# EAGLE design Supply-01 (EAGLE 6.2)
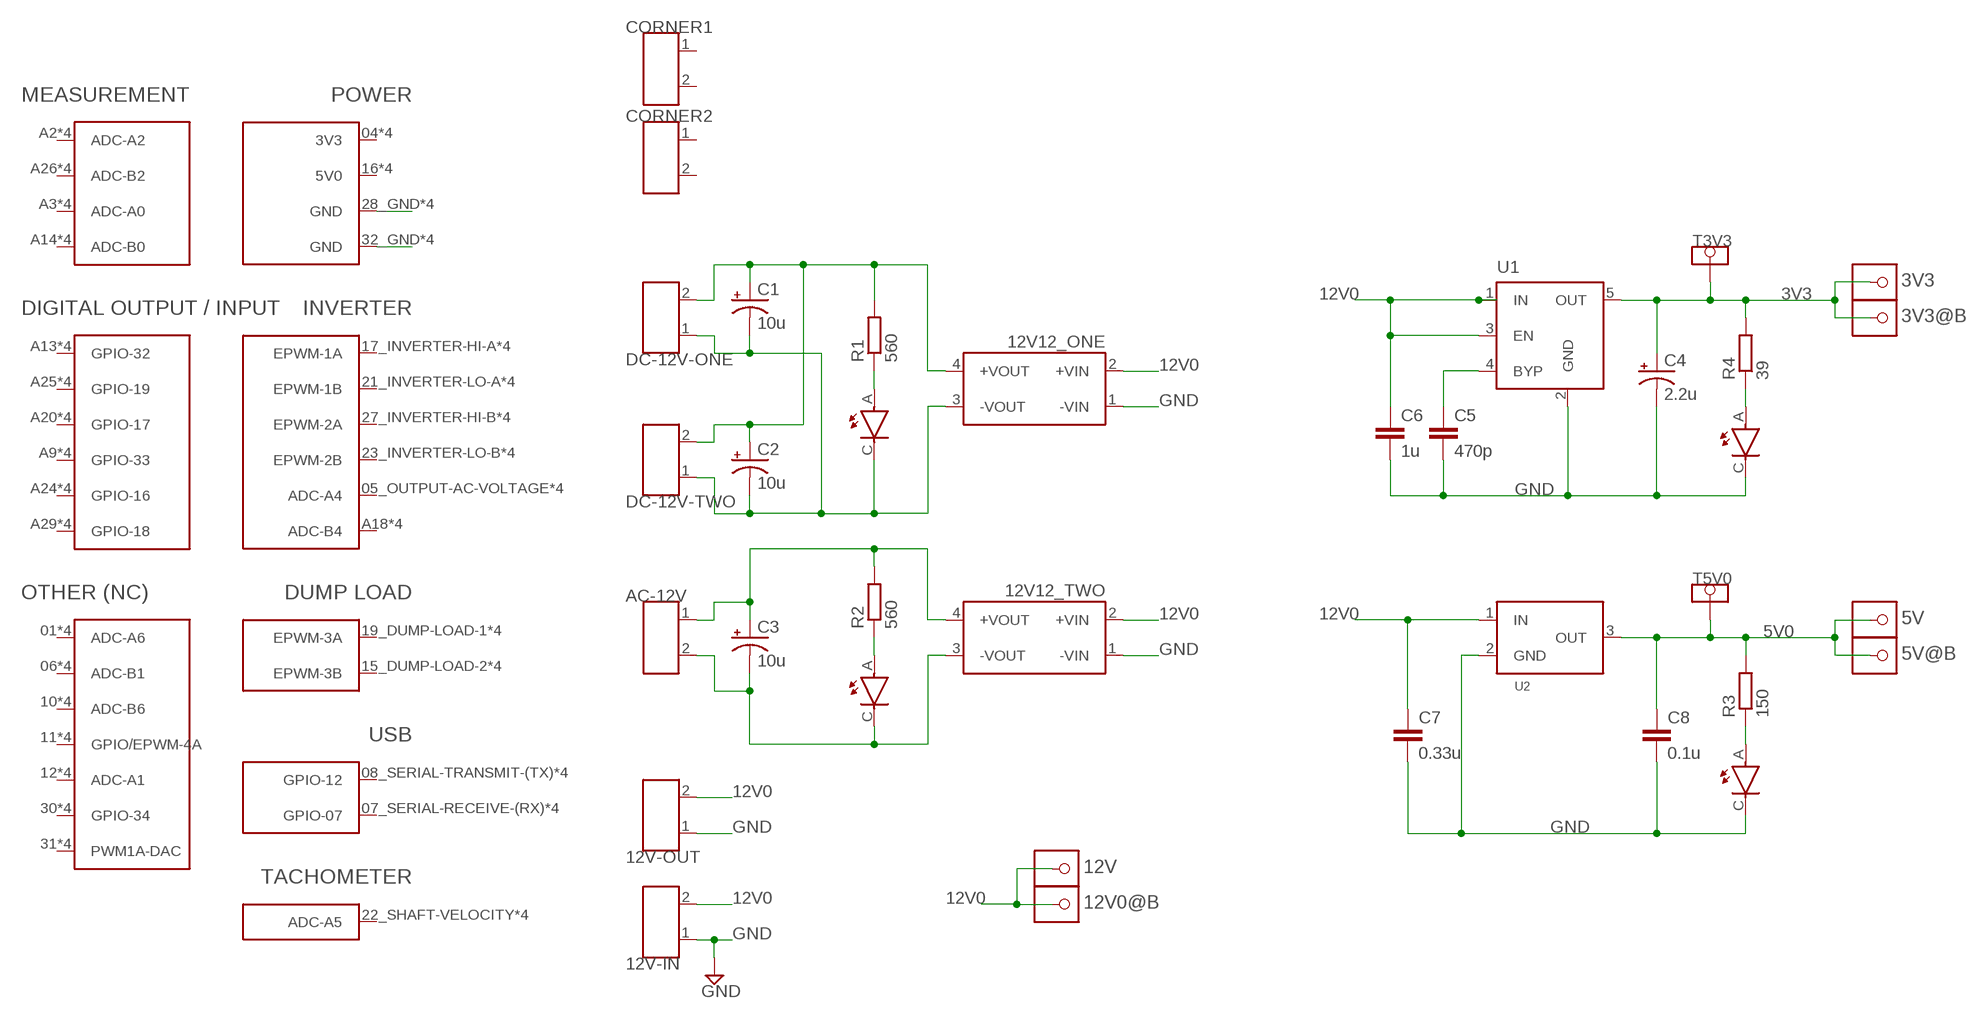
[diagram p0: schematic, sheet 1]

## Parts
3V3  1X1STACK  [1X1STACK]
3V3@B  1X1STACK  [1X1STACK]
5V  1X1STACK  [1X1STACK]
5V@B  1X1STACK  [1X1STACK]
12V  1X1STACK  [1X1STACK]
12V0@B  1X1STACK  [1X1STACK]
12V12_ONE  12V12_ISO_REG  [SIL_REG]
12V12_TWO  12V12_ISO_REG  [SIL_REG]
12V-IN  1X2_7,5_TB  [1X2_7,5_TB]
12V-OUT  1X2_7,5_TB  [1X2_7,5_TB]
AC-12V  1X2_7,5_TB  [1X2_7,5_TB]
C1  10u  CPOL-4MM  [CPOL-4.0MM]
C2  10u  CPOL-4MM  [CPOL-4.0MM]
C3  10u  CPOL-4MM  [CPOL-4.0MM]
C4  2.2u  CPOL-4MM  [CPOL-4.0MM]
C5  470p  C-EUC0805  [C0805]
C6  1u  C-EUC0805  [C0805]
C7  0.33u  C-EUC0805  [C0805]
C8  0.1u  C-EUC0805  [C0805]
CORNER1  1X2_7,5_TB  [1X2_7,5_TB]
CORNER2  1X2_7,5_TB  [1X2_7,5_TB]
DC-12V-ONE  1X2_7,5_TB  [1X2_7,5_TB]
DC-12V-TWO  1X2_7,5_TB  [1X2_7,5_TB]
H1  CONTROLLER_STACK  [CONTROLLER_STACK]
LED1  PLCC2  [PLCC2]
LED2  PLCC2  [PLCC2]
LED3  PLCC2  [PLCC2]
LED4  PLCC2  [PLCC2]
R1  560  R-EU_R0805  [R0805]
R2  560  R-EU_R0805  [R0805]
R3  150  R-EU_R0805  [R0805]
R4  39  R-EU_R0805  [R0805]
T3V3  TESTPAD  [TESTPAD]
T5V0  TESTPAD  [TESTPAD]
U1  MIC5219XX  [SOT23-5]
U2  10V5V-REG-H  [TO-220H]

## Nets
3V3: 3V3.P$2 3V3.P$5 3V3.P$58 3V3.P$65 3V3.PAD 3V3@B.P$2 3V3@B.P$5 3V3@B.P$58 3V3@B.P$65 3V3@B.PAD C4.+ R4.2 T3V3.TP U1.5(OUT)
5V0 [Power]: 5V.P$2 5V.P$5 5V.P$58 5V.P$65 5V.PAD 5V@B.P$2 5V@B.P$5 5V@B.P$58 5V@B.P$65 5V@B.PAD C8.1 R3.2 T5V0.TP U2.3(OUT)
12V0 [Power]: 12V0@B.P$2 12V0@B.P$5 12V0@B.P$58 12V0@B.P$65 12V0@B.PAD 12V12_ONE.2(+VIN) 12V12_TWO.2(+VIN) 12V-IN.2 12V-OUT.2 12V.P$2 12V.P$5 12V.P$58 12V.P$65 12V.PAD C6.1 C7.1 U1.1(IN) U1.3(EN) U2.1(IN)
GND [Power]: 12V12_ONE.1(-VIN) 12V12_TWO.1(-VIN) 12V-IN.1 12V-OUT.1 C4.- C5.2 C6.2 C7.2 C8.2 H1.28_GND(GND) H1.32_GND(GND) H1.A28(GND) H1.A32(GND) H1.B28(GND) H1.B32(GND) H1.C28(GND) H1.C32(GND) LED3.C LED4.C U1.2(GND) U2.2(GND)
N$1 [Power]: 12V12_ONE.4(+VOUT) C1.+ C2.+ DC-12V-ONE.2 DC-12V-TWO.2 R1.2
N$2 [Power]: 12V12_ONE.3(-VOUT) C1.- C2.- DC-12V-ONE.1 DC-12V-TWO.1 LED1.C
N$3: LED1.A R1.1
N$4: LED3.A R3.1
N$6 [Power]: 12V12_TWO.3(-VOUT) AC-12V.2 C3.- LED2.C
N$7: C5.1 U1.4(BYP)
N$8: LED2.A R2.1
N$10 [Power]: 12V12_TWO.4(+VOUT) AC-12V.1 C3.+ R2.2
N$12: LED4.A R4.1
Unconnected: CORNER1.1 CORNER1.2 CORNER2.1 CORNER2.2 H1.01(ADC-A6) H1.04(3V3) H1.05_OUTPUT-AC-VOLTAGE(ADC-A4) H1.06(ADC-B1) H1.07_SERIAL-RECEIVE-(RX)(GPIO-07) H1.08_SERIAL-TRANSMIT-(TX)(GPIO-12) H1.10(ADC-B6) H1.11(GPIO/EPWM-4A) H1.12(ADC-A1) H1.15_DUMP-LOAD-2(EPWM-3B) H1.16(5V0) H1.17_INVERTER-HI-A(EPWM-1A) H1.19_DUMP-LOAD-1(EPWM-3A) H1.21_INVERTER-LO-A(EPWM-1B) H1.22_SHAFT-VELOCITY(ADC-A5) H1.23_INVERTER-LO-B(EPWM-2B) H1.27_INVERTER-HI-B(EPWM-2A) H1.30(GPIO-34) H1.31(PWM1A-DAC) H1.A1(ADC-A6) H1.A2(ADC-A2) H1.A3(ADC-A0) H1.A4(3V3) H1.A5(ADC-A4) H1.A6(ADC-B1) H1.A7(GPIO-07) H1.A8(GPIO-12) H1.A9(GPIO-33) H1.A10(ADC-B6) H1.A11(GPIO/EPWM-4A) H1.A12(ADC-A1) H1.A13(GPIO-32) H1.A14(ADC-B0) H1.A15(EPWM-3B) H1.A16(5V0) H1.A17(EPWM-1A) H1.A18(ADC-B4) H1.A19(EPWM-3A) H1.A20(GPIO-17) H1.A21(EPWM-1B) H1.A22(ADC-A5) H1.A23(EPWM-2B) H1.A24(GPIO-16) H1.A25(GPIO-19) H1.A26(ADC-B2) H1.A27(EPWM-2A) H1.A29(GPIO-18) H1.A30(GPIO-34) H1.A31(PWM1A-DAC) H1.AC-INPUT-CURRENT_14(ADC-B0) H1.AC-OUTPUT-CURRENT_18(ADC-B4) H1.B1(ADC-A6) H1.B2(ADC-A2) H1.B3(ADC-A0) H1.B4(3V3) H1.B5(ADC-A4) H1.B6(ADC-B1) H1.B7(GPIO-07) H1.B8(GPIO-12) H1.B9(GPIO-33) H1.B10(ADC-B6) H1.B11(GPIO/EPWM-4A) H1.B12(ADC-A1) H1.B13(GPIO-32) H1.B14(ADC-B0) H1.B15(EPWM-3B) H1.B16(5V0) H1.B17(EPWM-1A) H1.B18(ADC-B4) H1.B19(EPWM-3A) H1.B20(GPIO-17) H1.B21(EPWM-1B) H1.B22(ADC-A5) H1.B23(EPWM-2B) H1.B24(GPIO-16) H1.B25(GPIO-19) H1.B26(ADC-B2) H1.B27(EPWM-2A) H1.B29(GPIO-18) H1.B30(GPIO-34) H1.B31(PWM1A-DAC) H1.C1(ADC-A6) H1.C2(ADC-A2) H1.C3(ADC-A0) H1.C4(3V3) H1.C5(ADC-A4) H1.C6(ADC-B1) H1.C7(GPIO-07) H1.C8(GPIO-12) H1.C9(GPIO-33) H1.C10(ADC-B6) H1.C11(GPIO/EPWM-4A) H1.C12(ADC-A1) H1.C13(GPIO-32) H1.C14(ADC-B0) H1.C15(EPWM-3B) H1.C16(5V0) H1.C17(EPWM-1A) H1.C18(ADC-B4) H1.C19(EPWM-3A) H1.C20(GPIO-17) H1.C21(EPWM-1B) H1.C22(ADC-A5) H1.C23(EPWM-2B) H1.C24(GPIO-16) H1.C25(GPIO-19) H1.C26(ADC-B2) H1.C27(EPWM-2A) H1.C29(GPIO-18) H1.C30(GPIO-34) H1.C31(PWM1A-DAC) H1.CLOCK-OUT-1_13(GPIO-32) H1.CLOCK-OUT-2_25(GPIO-19) H1.CLOCK_09(GPIO-33) H1.DATA-IN_24(GPIO-16) H1.DATA-OUT_20(GPIO-17) H1.DC-BRIDGE-CURRENT_02(ADC-A2) H1.DC-BRIDGE-VOLTAGE_26(ADC-B2) H1.INPUT-AC-VOLTAGE_03(ADC-A0) H1.LOAD_29(GPIO-18)

## Library data of the parts
3V3 3V3@B 5V 5V@B 12V 12V0@B = headers v6-2:1X1STACK
12V12_ONE 12V12_TWO = PCB_ControlStack:12V12_ISO_REG: Isolated Voltage regulator
12V-IN 12V-OUT AC-12V CORNER1 CORNER2 DC-12V-ONE DC-12V-TWO = headers v6-2:1X2_7,5_TB: Straight terminal block 7.5mm pitch
C1-C4 = PCB_ControlStack:CPOL-4MM
C5-C8 = rcl:C-EU: CAPACITOR, European symbol
H1 = PCB_ControlStack:CONTROLLER_STACK
LED1-LED4 = PCB_ControlStack:PLCC2
R1-R4 = rcl:R-EU_: RESISTOR, European symbol
T3V3 T5V0 = PCB_ControlStack:TESTPAD
U1 = v-reg-micrel:MIC5219XX: VOLTAGE REGULATOR; OC_FARNELL: unknown; OC_NEWARK: unknown
U2 = PCB_ControlStack:10V5V-REG-H

## Net classes
0 Signal: width 0.15 mm, drill 0.5 mm, clearance 0.6 mm
1 Power: width 1.42 mm, drill 0.8 mm, clearance 0.65 mm

## Board
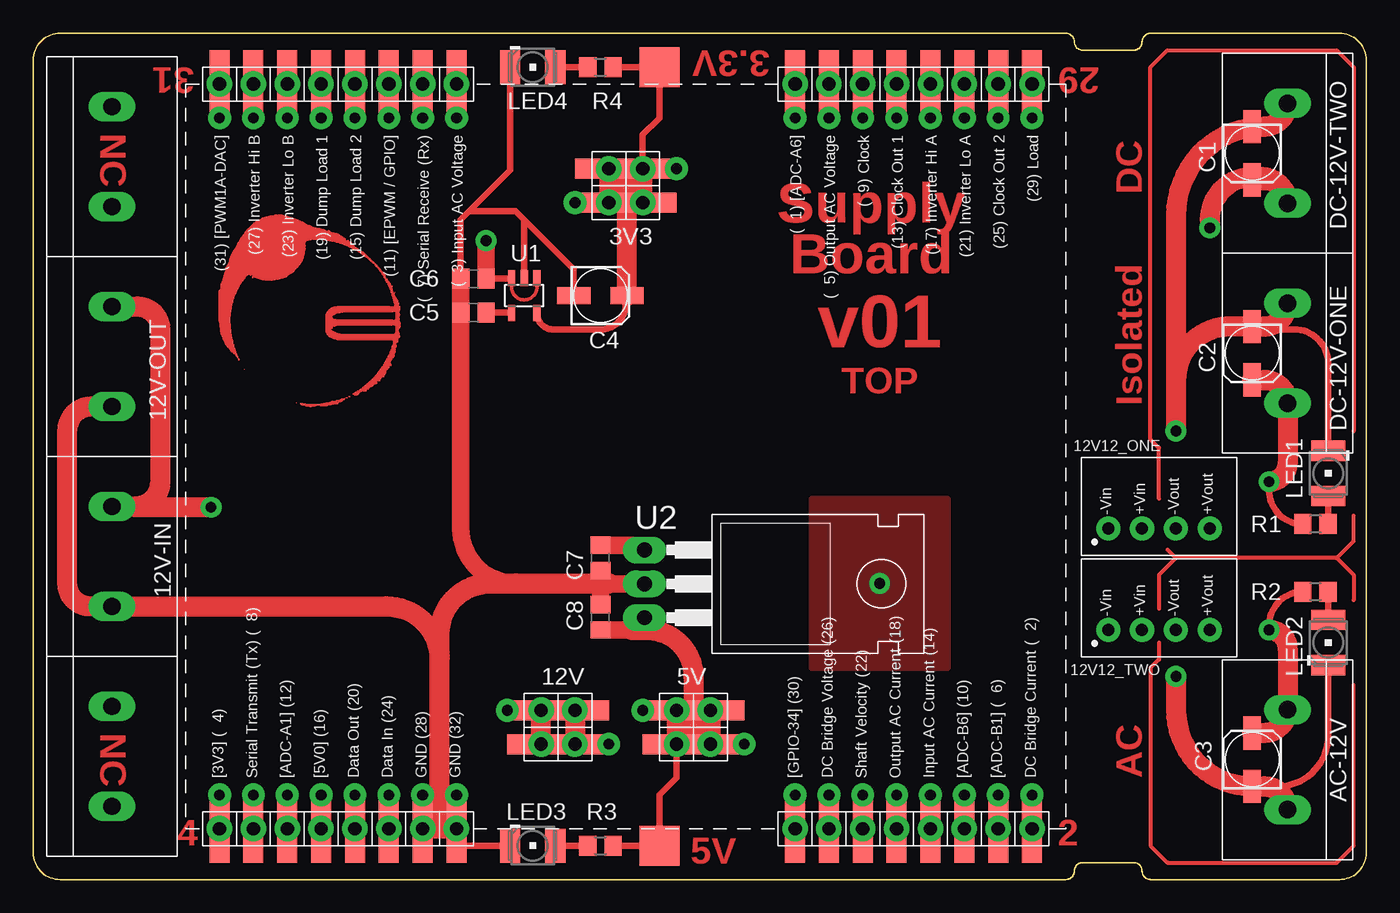
[diagram p1: board, top side]
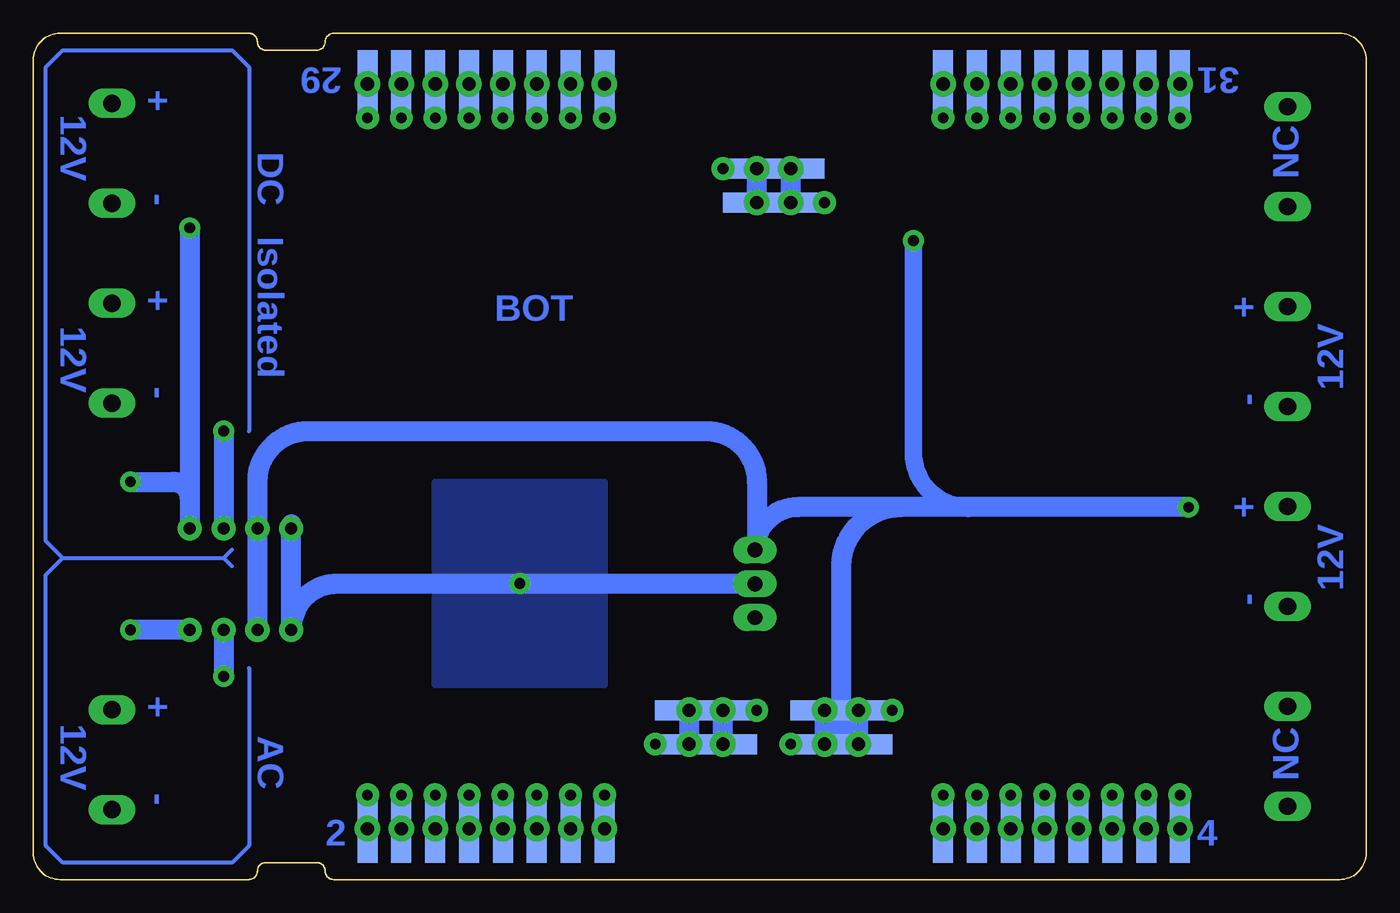
[diagram p2: board, bottom side, seen from below]

Size 100 x 63.5 mm. Coordinates in mm from the lower left corner, seen from the top.
Outline: 2,0 77.47,0 arc90 78.11,0.64 arc-90 78.74,1.27 82.55,1.27 arc-90 83.19,0.64 arc90 83.82,0 85.09,0 98,0 arc90 100,2 100,61.5 arc90 98,63.5 83.82,63.5 arc90 83.19,62.87 arc-90 82.55,62.23 78.74,62.23 arc-90 78.11,62.87 arc90 77.47,63.5 2,63.5 arc90 0,61.5 0,2 arc90 2,0
Copper layers (1*16): Top 0.035mm / dielectric 1.5mm / Bottom 0.035mm
Design rules: minimum track width 12mil, minimum drill 0.7mm, track to track 25mil, track to pad 20mil, pad to pad 15mil, via to via 20mil, smd to smd 0mil, copper to edge 40mil, drill to drill 10mil, minimum pad ring 18mil, minimum via ring 15mil, stop-mask expansion 0mil, vias tented up to drill 0mil, thermal gap 15mil
tRestrict: 8 lines
bRestrict: 8 lines

### Footprints (pad centres in the part's own frame; a part is rotated, then mirrored left to right if it is on the bottom)
1X1STACK = drill 1: P$2 -1.27,0; PAD 1.27,0 | drill 0.8: P$5 3.81,0 | smd 7.62 x 1.5 bottom: P$58 0,0 | smd 7.62 x 1.5: P$65 0,0
SIL_REG = drill 0.9 pad 1.422: 1 0,3.81; 2 0,1.27; 3 0,-1.27; 4 0,-3.81
1X2_7,5_TB = drill 1.3 long: 1 0,3.75; 2 0,-3.75
CPOL-4.0MM = smd 2.5 x 1.3: + 2,0; - -2,0
C0805 = smd 1.3 x 1.5: 1 -0.95,0; 2 0.95,0
CONTROLLER_STACK = drill 1: 01 -27.94,12.7; 04 27.94,-30.48; 05_OUTPUT-AC-VOLTAGE -27.94,15.24; 06 27.94,27.94; 07_SERIAL-RECEIVE-(RX) -27.94,-15.24; 08_SERIAL-TRANSMIT-(TX) 27.94,-27.94; 10 27.94,25.4; 11 -27.94,-17.78; 12 27.94,-25.4; 15_DUMP-LOAD-2 -27.94,-20.32; 16 27.94,-22.86; 17_INVERTER-HI-A -27.94,22.86; 19_DUMP-LOAD-1 -27.94,-22.86; 21_INVERTER-LO-A -27.94,25.4; 22_SHAFT-VELOCITY 27.94,17.78; 23_INVERTER-LO-B -27.94,-25.4; 27_INVERTER-HI-B -27.94,-27.94; 28_GND 27.94,-15.24; 30 27.94,12.7; 31 -27.94,-30.48; 32_GND 27.94,-12.7; AC-INPUT-CURRENT_14 27.94,22.86; AC-OUTPUT-CURRENT_18 27.94,20.32; CLOCK-OUT-1_13 -27.94,20.32; CLOCK-OUT-2_25 -27.94,27.94; CLOCK_09 -27.94,17.78; DATA-IN_24 27.94,-17.78; DATA-OUT_20 27.94,-20.32; DC-BRIDGE-CURRENT_02 27.94,30.48; DC-BRIDGE-VOLTAGE_26 27.94,15.24; INPUT-AC-VOLTAGE_03 -27.94,-12.7; LOAD_29 -27.94,30.48 | smd 5.08 x 1.5: A1 -27.94,12.7; A2 27.94,30.48; A3 -27.94,-12.7; A4 27.94,-30.48; A5 -27.94,15.24; A6 27.94,27.94; A7 -27.94,-15.24; A8 27.94,-27.94; A9 -27.94,17.78; A10 27.94,25.4; A11 -27.94,-17.78; A12 27.94,-25.4; A13 -27.94,20.32; A14 27.94,22.86; A15 -27.94,-20.32; A16 27.94,-22.86; A17 -27.94,22.86; A18 27.94,20.32; A19 -27.94,-22.86; A20 27.94,-20.32; A21 -27.94,25.4; A22 27.94,17.78; A23 -27.94,-25.4; A24 27.94,-17.78; A25 -27.94,27.94; A26 27.94,15.24; A27 -27.94,-27.94; A28 27.94,-15.24; A29 -27.94,30.48; A30 27.94,12.7; A31 -27.94,-30.48; A32 27.94,-12.7 | smd 5.08 x 1.5 bottom: B1 -27.94,12.7; B2 27.94,30.48; B3 -27.94,-12.7; B4 27.94,-30.48; B5 -27.94,15.24; B6 27.94,27.94; B7 -27.94,-15.24; B8 27.94,-27.94; B9 -27.94,17.78; B10 27.94,25.4; B11 -27.94,-17.78; B12 27.94,-25.4; B13 -27.94,20.32; B14 27.94,22.86; B15 -27.94,-20.32; B16 27.94,-22.86; B17 -27.94,22.86; B18 27.94,20.32; B19 -27.94,-22.86; B20 27.94,-20.32; B21 -27.94,25.4; B22 27.94,17.78; B23 -27.94,-25.4; B24 27.94,-17.78; B25 -27.94,27.94; B26 27.94,15.24; B27 -27.94,-27.94; B28 27.94,-15.24; B29 -27.94,30.48; B30 27.94,12.7; B31 -27.94,-30.48; B32 27.94,-12.7 | drill 0.8: C1 -25.4,12.7; C2 25.4,30.48; C3 -25.4,-12.7; C4 25.4,-30.48; C5 -25.4,15.24; C6 25.4,27.94; C7 -25.4,-15.24; C8 25.4,-27.94; C9 -25.4,17.78; C10 25.4,25.4; C11 -25.4,-17.78; C12 25.4,-25.4; C13 -25.4,20.32; C14 25.4,22.86; C15 -25.4,-20.32; C16 25.4,-22.86; C17 -25.4,22.86; C18 25.4,20.32; C19 -25.4,-22.86; C20 25.4,-20.32; C21 -25.4,25.4; C22 25.4,17.78; C23 -25.4,-25.4; C24 25.4,-17.78; C25 -25.4,27.94; C26 25.4,15.24; C27 -25.4,-27.94; C28 25.4,-15.24; C29 -25.4,30.48; C30 25.4,12.7; C31 -25.4,-30.48; C32 25.4,-12.7
PLCC2 = smd 2.54 x 1.524: A 0,1.702; C 0,-1.702
R0805 = smd 1.3 x 1.5: 1 -0.95,0; 2 0.95,0
TESTPAD = smd 3 x 3: TP 0,0
SOT23-5 = smd 0.55 x 1.2: 1 -0.95,-1.3; 2 0,-1.3; 3 0.95,-1.3; 4 0.95,1.3; 5 -0.95,1.3
TO-220H = drill 1.118 long: 1 -2.54,-7.62; 2 0,-7.62; 3 2.54,-7.62

### Placement (x,y rotation side)
3V3  44.45,53.34 0 top
3V3@B  44.45,50.8 180 top
5V  49.53,12.7 180 top
5V@B  49.53,10.16 0 top
12V  39.37,12.7 180 top
12V0@B  39.37,10.16 0 top
12V12_ONE  84.45,26.35 90 top
12V12_TWO  84.45,18.73 90 top
12V-IN  5.9,24.25 180 top
12V-OUT  5.9,39.25 180 top
AC-12V  94.1,9 0 top
C1  91.44,54.5 270 top
C2  91.44,39.5 270 top
C3  91.44,9 90 top
C4  42.55,43.81 0 top
C5  33.02,42.55 180 top
C6  33.02,45.09 180 top
C7  42.55,24.13 270 top
C8  42.55,19.68 90 top
CORNER1  5.9,54.25 180 top
CORNER2  5.9,9.25 180 top
DC-12V-ONE  94.1,39.5 0 top
DC-12V-TWO  94.1,54.5 0 top
H1  44.45,31.75 270 top
LED1  97.16,30.48 180 top
LED2  97.16,17.78 0 top
LED3  37.47,2.54 270 top
LED4  37.47,60.96 270 top
R1  96.19,26.67 180 top
R2  96.19,21.59 180 top
R3  42.55,2.54 0 top
R4  42.55,60.96 0 top
T3V3  46.99,60.96 0 top
T5V0  46.99,2.54 0 top
U1  36.83,43.81 180 top
U2  53.47,22.19 270 top

### Tracks (layer width: path | path; a pad name or v marks a point on that pad's centre or on a via)
3V3
  Top 0.5: R4.2 T3V3.TP 46.99,57.15 45.72,55.88 3V3.PAD | U1.5 arc90 39.02,41.27 42.55,41.27 arc90 44.45,43.18 44.45,43.72 arc-90 C4.+
  Top 1.5: 3V3@B.P$5 3V3@B.PAD | 3V3@B.PAD 3V3@B.P$65 | 3V3.P$5 3V3.PAD | 3V3@B.PAD 3V3.P$2 3V3.P$65 | 3V3@B.P$2 3V3.PAD | 3V3.PAD 3V3.P$65 | C4.+ 44.55,53.24 arc90 3V3.P$65
  Bottom 1.5: 3V3@B.P$5 3V3@B.PAD | 3V3@B.PAD 3V3@B.P$65 | 3V3.P$5 3V3.PAD | 3V3.PAD 3V3.P$65 | 3V3.P$2 3V3@B.PAD | 3V3@B.PAD 3V3@B.P$2 3V3.PAD
5V0
  Top 0.5: R3.2 T5V0.TP 46.99,6.35 48.26,7.62 5V@B.P$2
  Top 1.3: C8.1 44.93,18.73 arc90 U2.3
  Top 1.5: 5V@B.P$5 5V@B.PAD | 5V@B.PAD 5V@B.P$65 | 5V.PAD 5V.P$65 | 5V.P$2 5V@B.PAD | 5V.P$5 5V.PAD | 5V.PAD 5V@B.P$2 5V@B.P$65 | 44.93,18.73 46.04,18.73 arc-90 49.53,15.24 5V@B.P$65
  Bottom 1.5: 5V.P$65 5V.PAD | 5V.PAD 5V.P$5 | 5V@B.P$65 5V@B.PAD | 5V@B.PAD 5V@B.P$5 | 5V@B.P$2 5V.PAD | 5V.PAD 5V.P$2 5V@B.PAD
12V0  (via drill 0.8)
  Top 0.25: U1.1 37.78,44.45 arc-90 36.83,43.5 arc-90 35.88,44.45 U1.3
  Top 0.5: C6.1 35.85,45.09 arc90 U1.3
  Top 1.3: C7.1 45.51,25.08 arc-90 U2.1 | C6.1 v33.97,47.94
  Top 1.5: 12V.P$65 12V.PAD | 12V.PAD 12V.P$5 | 12V0@B.P$65 12V0@B.PAD | 12V0@B.PAD 12V0@B.P$5 | 12V0@B.P$2 12V.PAD | 12V.P$2 12V0@B.PAD | 12V-IN.2 7.68,28 arc90 9.53,29.84 | 12V-OUT.2 7.8,43 arc-90 9.53,41.27 9.53,29.84 | 9.53,29.84 arc-90 7.62,27.94 v13.34,27.94
  Bottom 1.3: v33.97,47.94 33.97,32.06 arc-90 29.84,27.94
  Bottom 1.5: 12V.P$65 12V.PAD | 12V.PAD 12V.P$5 | 12V0@B.PAD 12V0@B.P$5 | 12V0@B.P$2 12V.PAD | 12V.PAD 12V.P$2 12V0@B.PAD | 12V12_TWO.2 12V12_ONE.2 83.19,29.84 arc90 79.38,33.66 49.53,33.66 arc90 45.72,29.84 45.72,24.86 arc90 U2.1 arc90 42.65,27.94 34.92,27.94 | v13.34,27.94 29.84,27.94 34.92,27.94 | 12V0@B.PAD 12V0@B.P$65 39.37,23.5 arc90 34.92,27.94
GND  (via drill 0.8)
  Top 0.5: LED3.C 31.75,2.54 H1.B32 | C6.2 32.07,49.53 32.7,50.16 | U1.2 36.83,49.53 | 36.83,49.53 36.2,50.16 32.7,50.16 | LED4.C 35.76,53.22 32.7,50.16 | C4.- 40.55,45.81 36.83,49.53
  Top 1.3: C8.2 42.55,22.23 | 42.55,22.23 C7.2 | U2.2 43.18,22.19 42.58,22.19 arc-90 42.55,22.23 | C6.2 C5.2 32.07,26.35 arc90 36.2,22.23
  Top 1.5: H1.C28 H1.C32 H1.B32 30.48,3.81 | 30.48,3.81 H1.B28 | 12V-OUT.1 4.38,35.5 arc90 2.54,33.66 2.54,22.23 arc90 4.26,20.5 12V-IN.1 26.49,20.5 arc-90 30.48,16.51 | 30.48,3.81 30.48,16.51 | 30.48,16.51 30.48,18.41 arc-90 34.29,22.23 36.2,22.23 43.15,22.23 arc-90 43.18,22.19
  Bottom 0.406: 67.5,22.2 67.5,22.19 63.5,22.19 v63.5,22.23
  Bottom 1.5: 80.64,26.67 12V12_ONE.1 12V12_TWO.1 arc90 77.19,22.19 67.5,22.19 U2.2
  pour Bottom: 69.85,29.84 57.15,29.84 57.15,14.61 69.85,14.61
  pour Top: 68.58,28.57 58.42,28.57 58.42,15.88 68.58,15.88
N$1  (via drill 0.8)
  Top 0.5: R1.2 arc-90 92.71,29.2 v92.71,29.84
  Top 1.5: C2.+ 92.35,37.5 arc-90 DC-12V-ONE.2 94.1,31.23 arc-90 v92.71,29.84 | C1.+ 92.35,52.5 arc-90 DC-12V-TWO.2 | DC-12V-TWO.2 arc90 92.14,52.7 | DC-12V-TWO.2 arc90 92.14,52.7 | 92.14,52.7 91.44,52.7 arc90 88.27,49.53 v88.27,48.9
  Bottom 1.5: v92.71,29.84 89.53,29.84 arc90 88.27,28.57 12V12_ONE.4 v88.27,48.9
N$2  (via drill 0.8)
  Top 0.5: LED1.C 97.16,38.73 arc90 94.61,41.27 91.67,41.27 C2.-
  Top 1.5: DC-12V-ONE.1 arc-90 92.35,41.5 C2.- 89.76,41.5 arc90 85.72,37.47 | C1.- 92.35,56.5 | 92.35,56.5 arc90 DC-12V-TWO.1 | 92.35,56.5 arc90 85.72,49.88 85.72,37.47 | 85.72,37.47 v85.72,33.66
  Bottom 1.5: v85.72,33.66 12V12_ONE.3
N$3
  Top 0.5: LED1.A 97.16,26.68 arc-90 R1.1
N$4
  Top 0.5: LED3.A R3.1
N$5
  Top 0.3: 84.45,28.57 84.45,32.38 83.82,33.02 83.82,60.96 85.09,62.23 97.79,62.23 99.06,60.96 99.06,33.66
N$6  (via drill 0.8)
  Top 0.5: LED2.C 97.16,10.79 arc-90 93.34,6.99 91.45,6.99 arc-90 C3.-
  Top 1.5: AC-12V.2 arc90 92.35,7 C3.- arc-90 85.72,12.71 v85.72,15.24
  Bottom 1.5: 12V12_TWO.3 v85.72,15.24
N$7
  Top 0.5: C5.1 35.85,42.55 arc-90 U1.4
N$8
  Top 0.5: LED2.A 97.16,21.57 arc90 R2.1
N$10  (via drill 0.8)
  Top 0.5: R2.2 arc90 92.71,19.06 v92.71,18.73
  Top 1.5: C3.+ 92.35,11 arc90 AC-12V.1 94.1,17.34 arc90 v92.71,18.73
  Bottom 1.5: 12V12_TWO.4 v92.71,18.73
N$11
  Top 0.3: 97.79,24.13 99.06,25.4 99.06,27.3 | 97.79,24.13 99.06,22.86 99.06,20.95 | 97.79,24.13 85.72,24.13 | 85.72,24.13 84.45,22.86 84.45,20.32 | 85.72,24.13 85.09,24.77
N$12
  Top 0.5: LED4.A R4.1
N$13
  Top 0.3: 84.45,17.78 84.45,16.51 83.82,15.88 83.82,2.54 85.09,1.27 97.79,1.27 99.06,2.54 99.06,14.61
N$14
  Bottom 0.3: 83.82,15.88 83.82,2.54 85.09,1.27 97.79,1.27 99.06,2.54 99.06,22.86 97.79,24.13 | 97.79,24.13 85.72,24.13 | 85.72,24.13 85.09,23.5 | 85.72,24.13 85.09,24.77 | 97.79,24.13 99.06,25.4 99.06,60.96 97.79,62.23 85.09,62.23 83.82,60.96 83.82,33.66
(copper drawn outside any net)
  shapes: Top area x1034

### Text on the board
Top: 3.3V | 31 | 29 | NC | Supply | DC | Board | v01 | TOP | Isolated | NC | AC | 4 | 5V | 2
Bottom: 31 | 29 | + | 12V | DC | NC | - | Isolated | + | BOT | + | 12V | 12V | - | - | + | 12V | - | + | 12V | AC | NC | - | 4 | 2